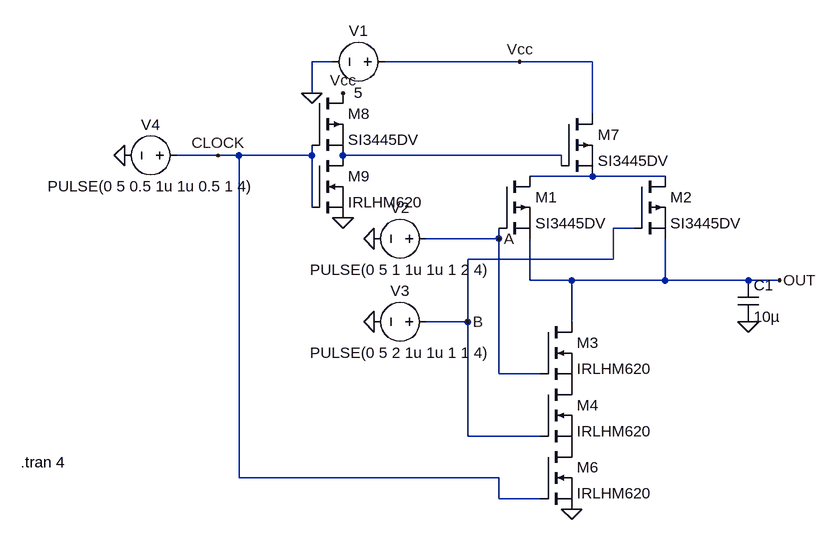
[diagram p0: schematic NAND C2.asc]
NAND C2.asc, the LTspice schematic file:
Version 4.1
SHEET 1 880 708
WIRE -144 -128 -176 -128
WIRE 144 -128 -64 -128
WIRE 256 -128 144 -128
WIRE -176 -80 -176 -128
WIRE 256 -48 256 -128
WIRE -320 16 -384 16
WIRE -288 16 -320 16
WIRE -176 16 -176 0
WIRE -176 16 -288 16
WIRE 208 16 -128 16
WIRE 208 32 208 16
WIRE 256 48 160 48
WIRE 368 48 256 48
WIRE -176 96 -176 16
WIRE 320 128 288 128
WIRE 112 144 112 128
WIRE 112 144 0 144
WIRE 288 176 288 128
WIRE 288 176 64 176
WIRE 160 208 160 144
WIRE 224 208 160 208
WIRE 368 208 368 144
WIRE 368 208 224 208
WIRE 496 208 368 208
WIRE 544 208 496 208
WIRE 64 272 64 176
WIRE 64 272 0 272
WIRE 224 272 224 208
WIRE 112 352 112 144
WIRE 176 352 112 352
WIRE 64 448 64 272
WIRE 176 448 64 448
WIRE -288 512 -288 16
WIRE 112 512 -288 512
WIRE 112 544 112 512
WIRE 176 544 112 544
FLAG -176 -80 0
FLAG 144 -128 Vcc
FLAG -80 144 0
FLAG -80 272 0
FLAG 112 144 A
FLAG 64 272 B
FLAG -464 16 0
FLAG -320 16 CLOCK
FLAG 224 560 0
FLAG -128 -80 Vcc
FLAG -128 112 0
FLAG 544 208 OUT
FLAG 496 272 0
SYMBOL voltage -48 -128 R90
WINDOW 0 -32 56 VBottom 2
WINDOW 3 32 56 VTop 2
WINDOW 123 0 0 Left 0
WINDOW 39 0 0 Left 0
SYMATTR InstName V1
SYMATTR Value 5
SYMBOL nmos 176 272 R0
SYMATTR InstName M3
SYMATTR Value IRLHM620
SYMBOL voltage 16 144 R90
WINDOW 0 -32 56 VBottom 2
WINDOW 3 32 56 VTop 2
WINDOW 123 0 0 Left 0
WINDOW 39 0 0 Left 0
SYMATTR InstName V2
SYMATTR Value PULSE(0 5 1 1u 1u 1 2 4)
SYMBOL voltage 16 272 R90
WINDOW 0 -32 56 VBottom 2
WINDOW 3 32 56 VTop 2
WINDOW 123 0 0 Left 0
WINDOW 39 0 0 Left 0
SYMATTR InstName V3
SYMATTR Value PULSE(0 5 2 1u 1u 1 1 4)
SYMBOL pmos 208 -48 R0
SYMATTR InstName M7
SYMATTR Value SI3445DV
SYMBOL voltage -368 16 R90
WINDOW 0 -32 56 VBottom 2
WINDOW 3 32 56 VTop 2
WINDOW 123 0 0 Left 0
WINDOW 39 0 0 Left 0
SYMATTR InstName V4
SYMATTR Value PULSE(0 5 0.5 1u 1u 0.5 1 4)
SYMBOL pmos 112 48 R0
SYMATTR InstName M1
SYMATTR Value SI3445DV
SYMBOL pmos 320 48 R0
SYMATTR InstName M2
SYMATTR Value SI3445DV
SYMBOL nmos 176 368 R0
SYMATTR InstName M4
SYMATTR Value IRLHM620
SYMBOL nmos 176 464 R0
SYMATTR InstName M6
SYMATTR Value IRLHM620
SYMBOL pmos -176 -80 R0
SYMATTR InstName M8
SYMATTR Value SI3445DV
SYMBOL nmos -176 16 R0
SYMATTR InstName M9
SYMATTR Value IRLHM620
SYMBOL cap 480 208 R0
SYMATTR InstName C1
SYMATTR Value 10µ
TEXT -624 488 Left 2 !.tran 4

The netlist it stands for:
* NAND C2.asc
V1 Vcc 0 5
M3 OUT A P001 P001 IRLHM620
V2 A 0 PULSE(0 5 1 1u 1u 1 2 4)
V3 B 0 PULSE(0 5 2 1u 1u 1 1 4)
M7 Vcc N001 N002 N002 SI3445DV
V4 CLOCK 0 PULSE(0 5 0.5 1u 1u 0.5 1 4)
M1 N002 A OUT OUT SI3445DV
M2 N002 B OUT OUT SI3445DV
M4 P001 B P002 P002 IRLHM620
M6 P002 CLOCK 0 0 IRLHM620
M8 Vcc CLOCK N001 N001 SI3445DV
M9 N001 CLOCK 0 0 IRLHM620
C1 OUT 0 10µ
.model NMOS NMOS
.model PMOS PMOS
.lib standard.mos
.tran 4
.backanno
.end